# Altium schematic sheet BMS.SchDoc
size A; SheetNumber: 0
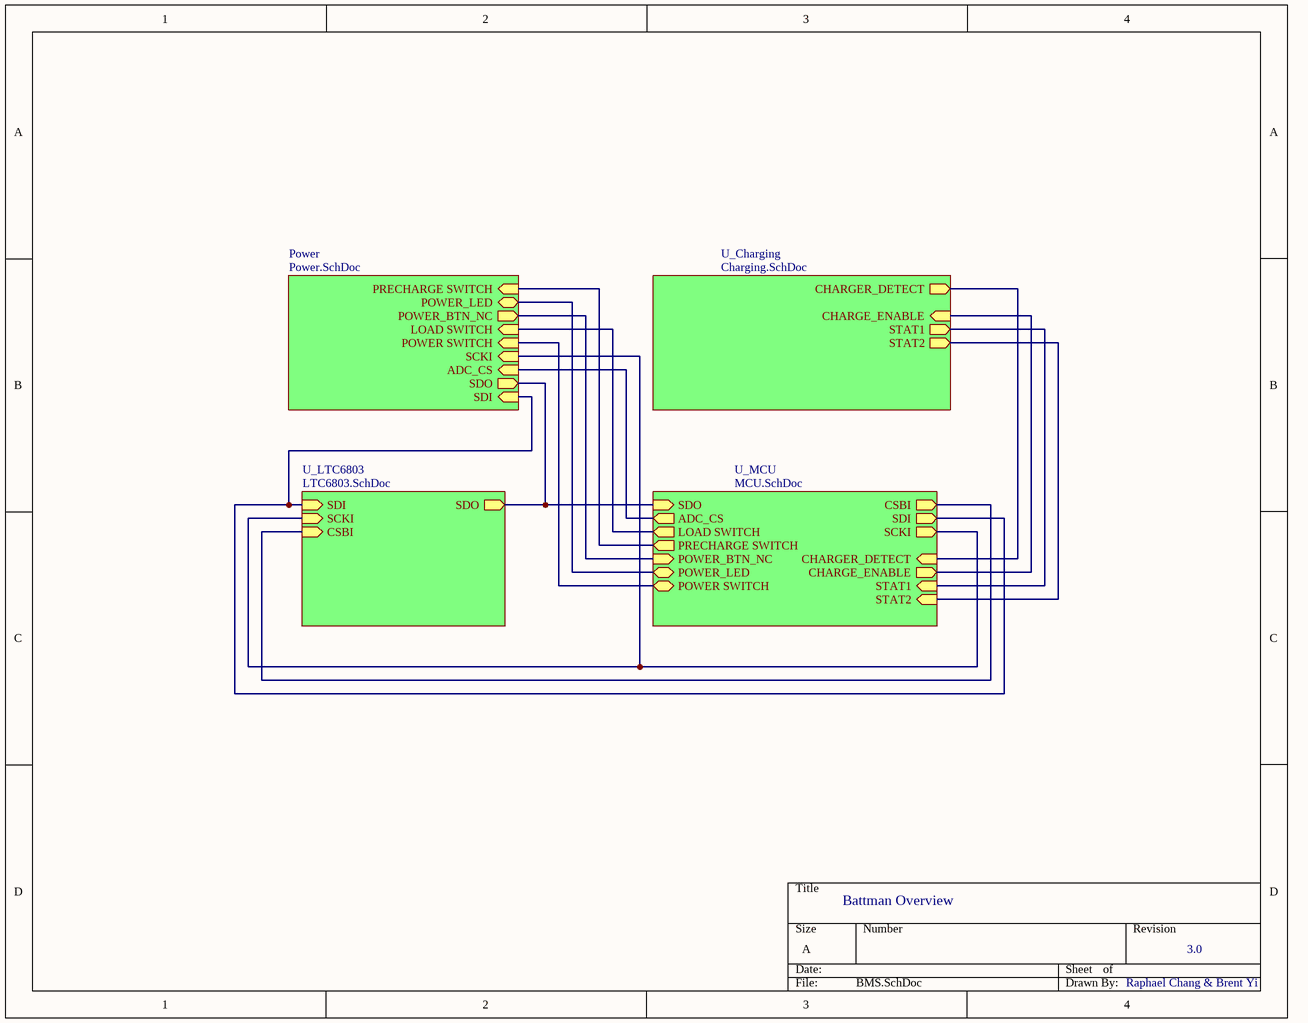
[diagram p0: BMS.SchDoc]

## Sub-sheets
Power = Power.SchDoc: PRECHARGE SWITCH (in), POWER_LED, POWER_BTN_NC (out), LOAD SWITCH (in), POWER SWITCH (in), SCKI (in), ADC_CS (in), SDO (out), SDI (in)
U_Charging = Charging.SchDoc: CHARGER_DETECT (out), CHARGE_ENABLE (in), STAT1 (out), STAT2 (out)
U_LTC6803 = LTC6803.SchDoc: SDI (in), SCKI (in), SDO (out), CSBI (in)
U_MCU = MCU.SchDoc: CSBI (out), SDI (out), SDO (in), SCKI (out), CHARGER_DETECT (in), CHARGE_ENABLE (out), STAT1 (in), STAT2 (in), ADC_CS (out), LOAD SWITCH (out), PRECHARGE SWITCH (out), POWER_BTN_NC (in), POWER_LED, POWER SWITCH

## Nets
(unnamed): sheet U_LTC6803/SDI, sheet U_MCU/SDI, sheet Power/SDI
(unnamed): sheet U_LTC6803/SCKI, sheet U_MCU/SCKI, sheet Power/SCKI
(unnamed): sheet U_LTC6803/SDO, sheet U_MCU/SDO, sheet Power/SDO
(unnamed): sheet U_LTC6803/CSBI, sheet U_MCU/CSBI
(unnamed): sheet U_MCU/CHARGER_DETECT, sheet U_Charging/CHARGER_DETECT
(unnamed): sheet U_MCU/CHARGE_ENABLE, sheet U_Charging/CHARGE_ENABLE
(unnamed): sheet U_MCU/STAT1, sheet U_Charging/STAT1
(unnamed): sheet U_MCU/STAT2, sheet U_Charging/STAT2
(unnamed): sheet U_MCU/ADC_CS, sheet Power/ADC_CS
(unnamed): sheet U_MCU/LOAD SWITCH, sheet Power/LOAD SWITCH
(unnamed): sheet U_MCU/PRECHARGE SWITCH, sheet Power/PRECHARGE SWITCH
(unnamed): sheet U_MCU/POWER_BTN_NC, sheet Power/POWER_BTN_NC
(unnamed): sheet U_MCU/POWER_LED, sheet Power/POWER_LED
(unnamed): sheet U_MCU/POWER SWITCH, sheet Power/POWER SWITCH

## Notes on the sheet
- Battman Overview
- 3.0
- Raphael Chang & Brent Yi